# Altium schematic sheet 17 PM8916_LDO.SchDoc
size 868 x 579 mm
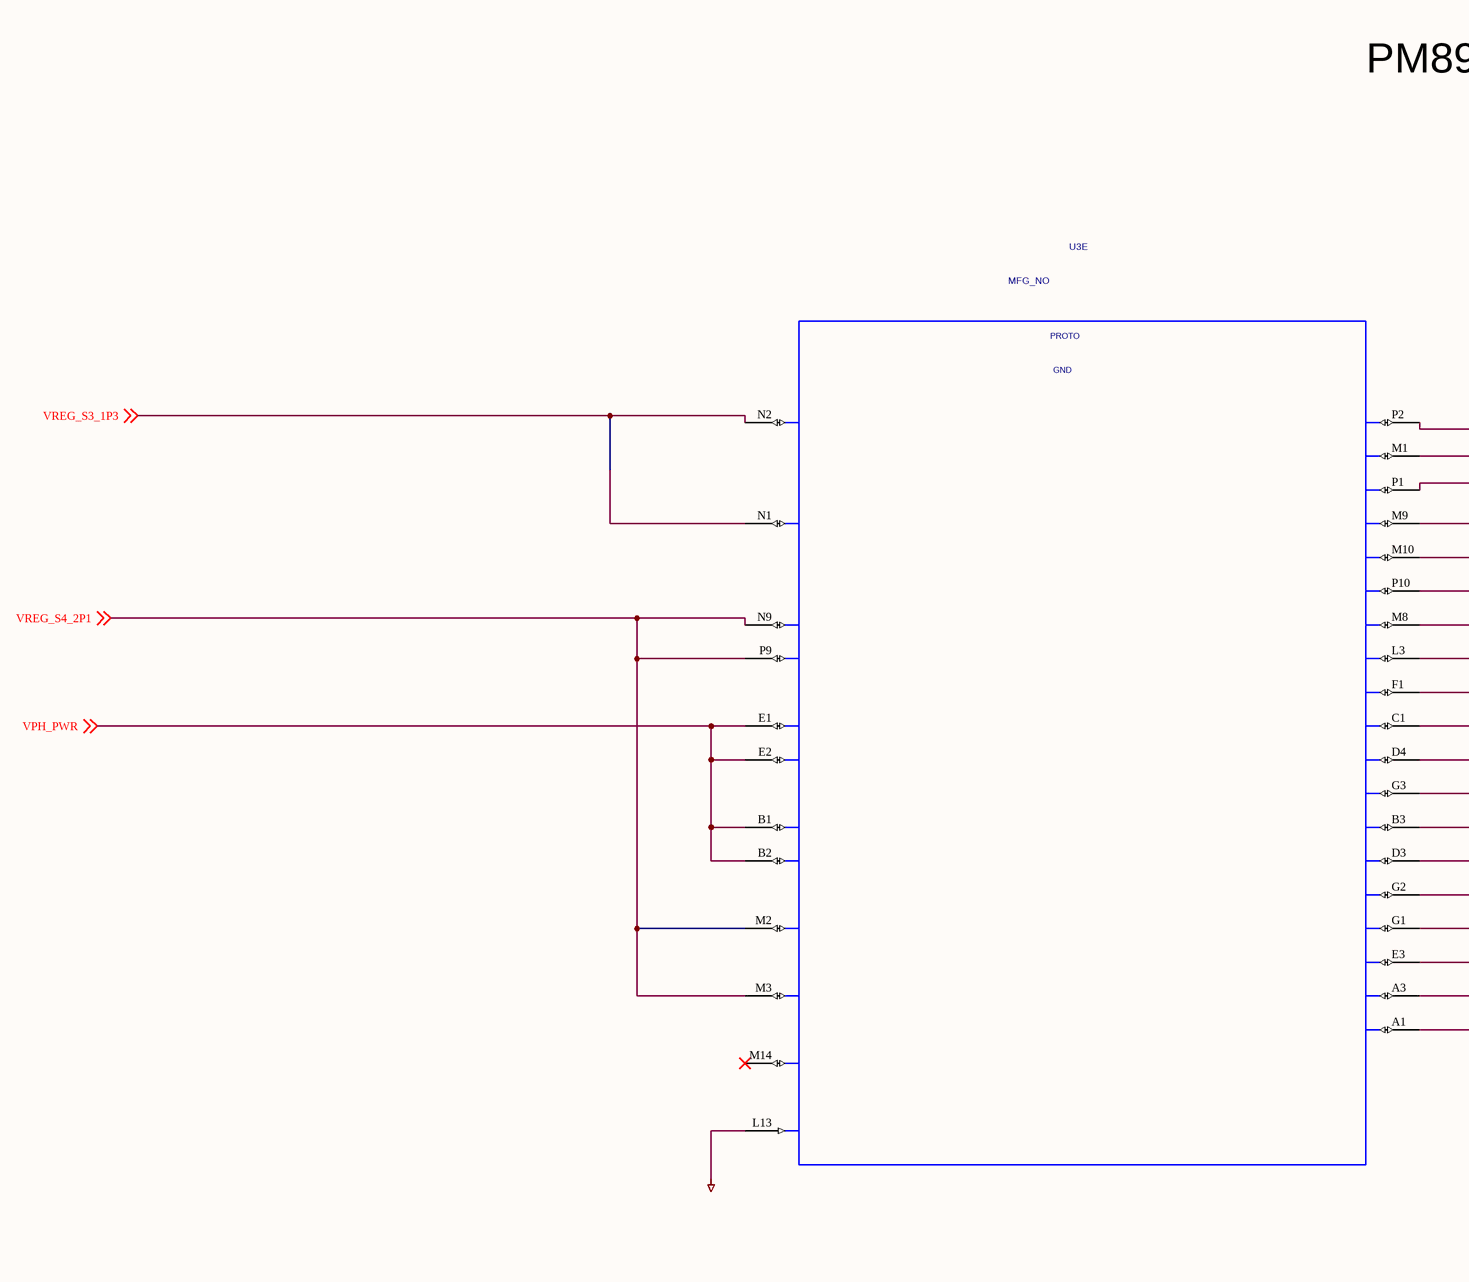
[diagram p0: 17 PM8916_LDO.SchDoc, top left]
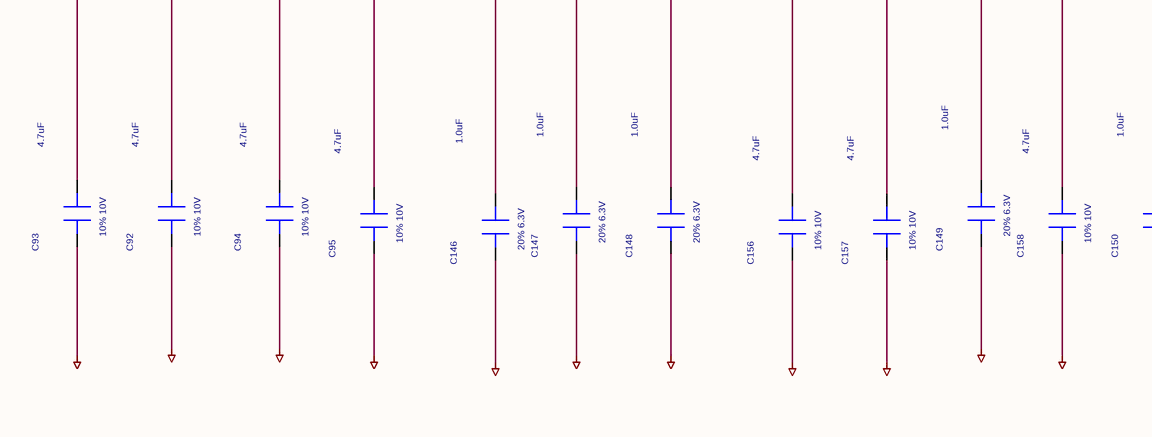
[diagram p1: 17 PM8916_LDO.SchDoc, top middle]
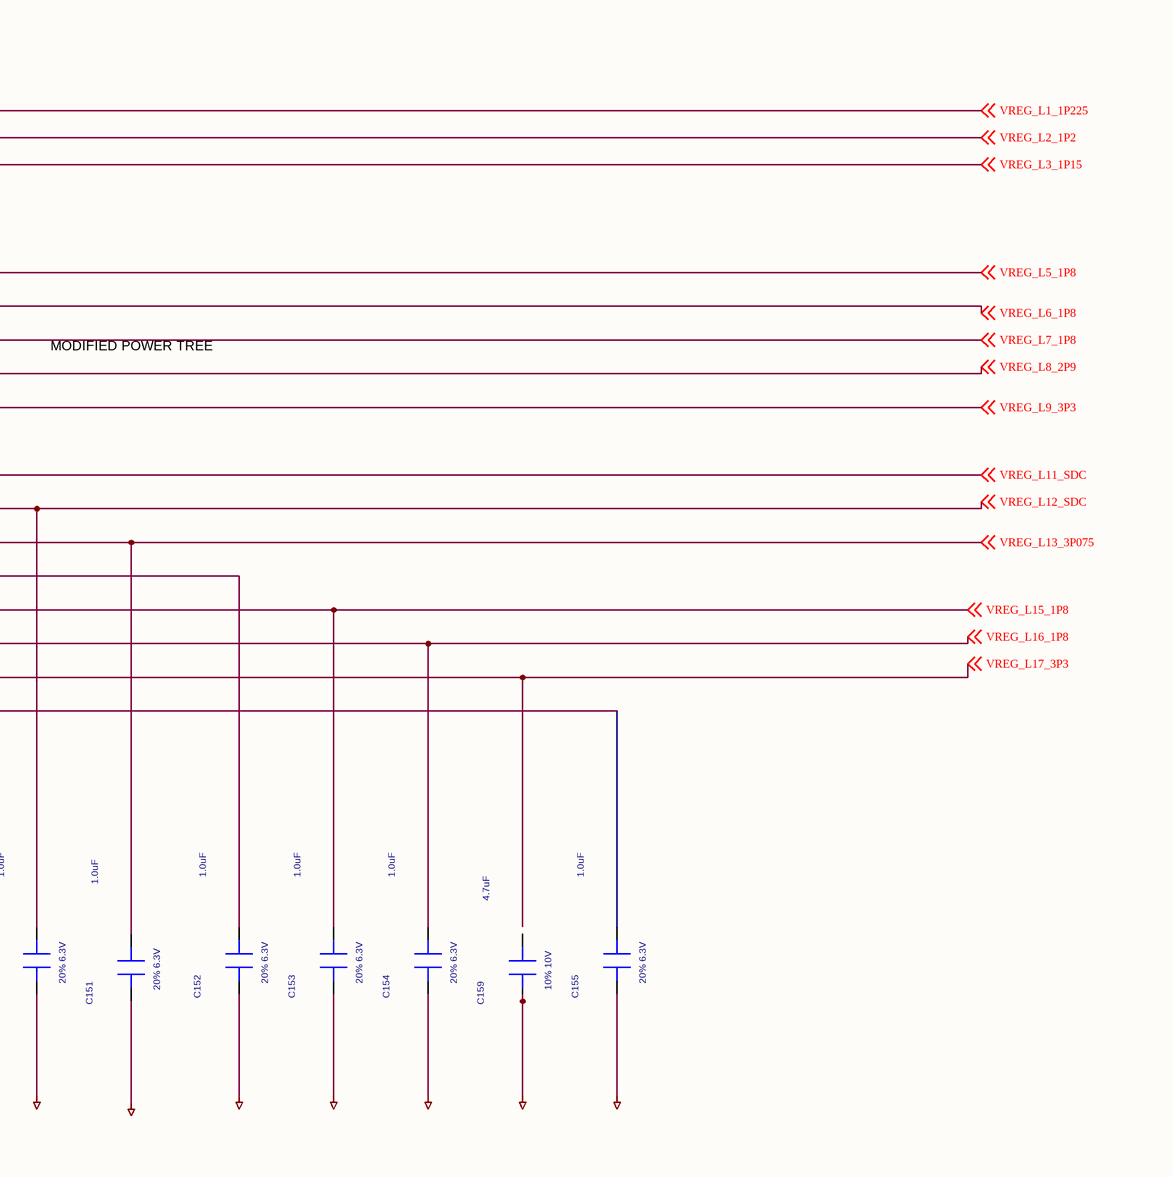
[diagram p2: 17 PM8916_LDO.SchDoc, top right]
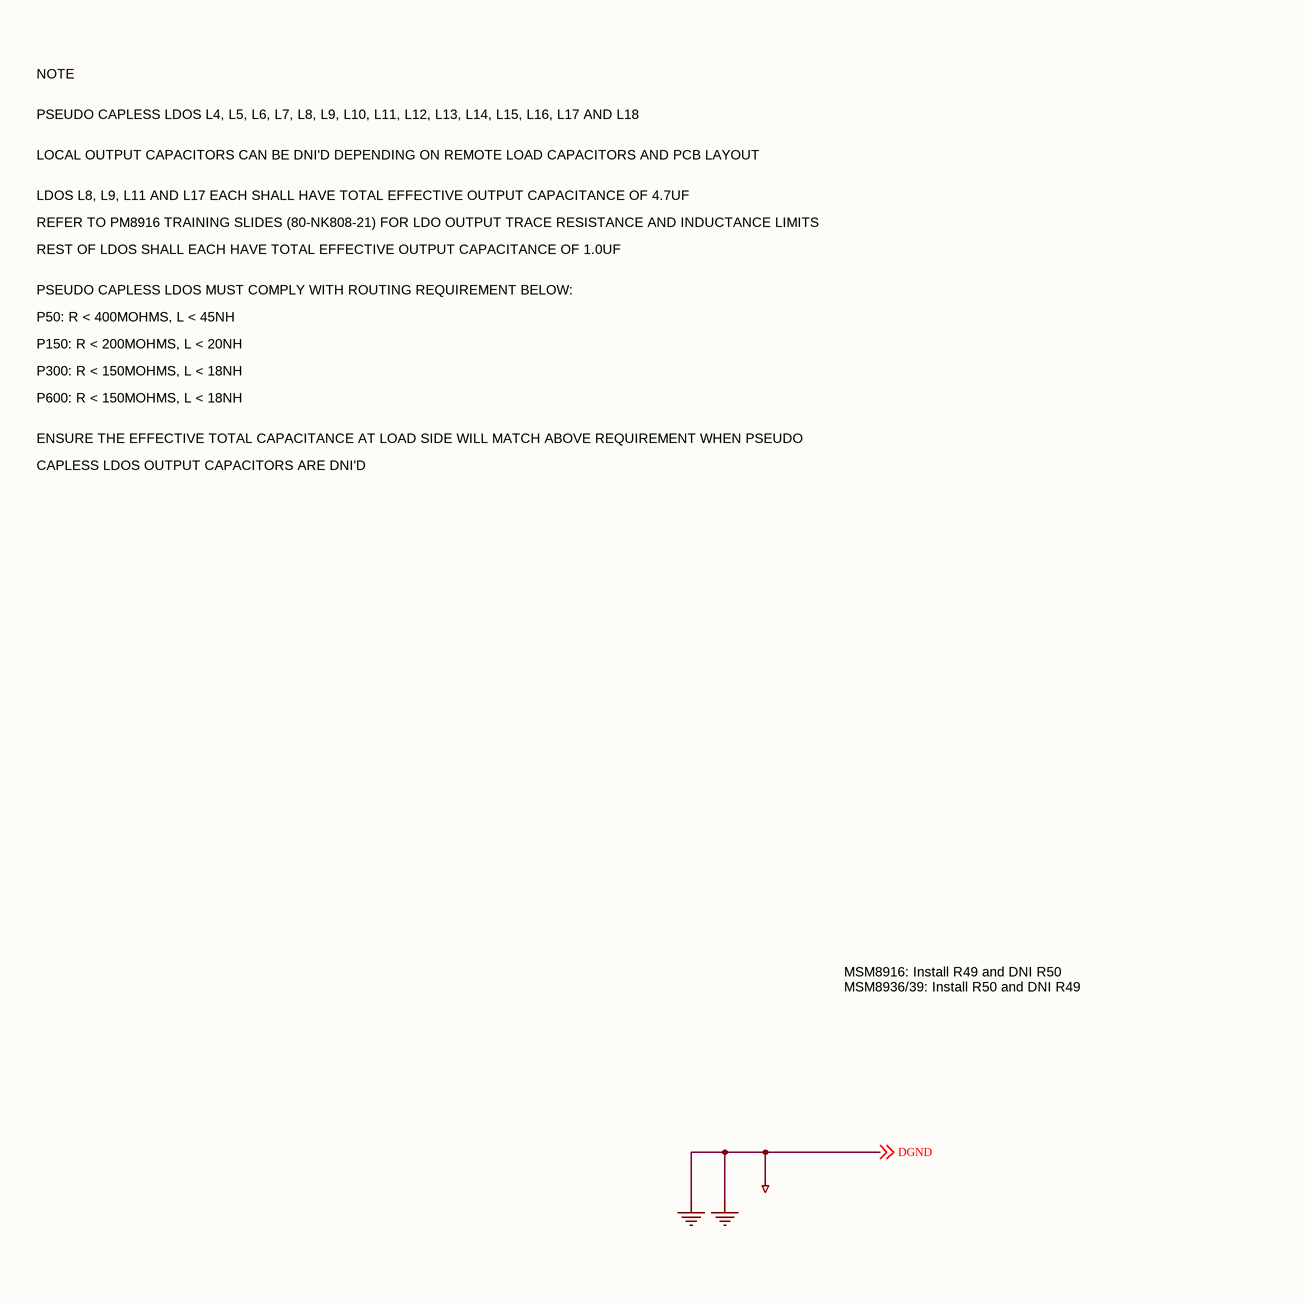
[diagram p3: 17 PM8916_LDO.SchDoc, bottom left]
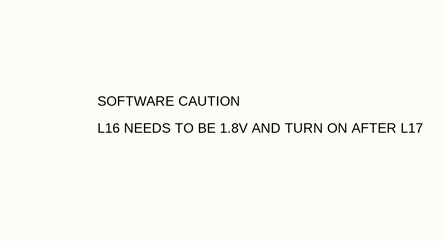
[diagram p4: 17 PM8916_LDO.SchDoc, bottom middle]
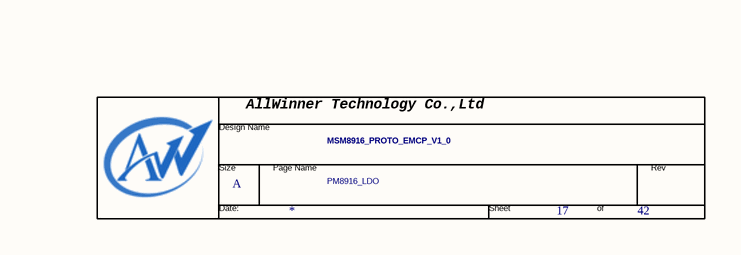
[diagram p5: 17 PM8916_LDO.SchDoc, bottom right]

## Parts
*  Page Count: 42  Page Number: 17  Page Size: A  Title: MSM8916_PROTO_EMCP_V1_0  Doc: PM8916_LDO  (hidden comment: TitleBlock0-AW)  (graphical)
C92  4.7uF  Tolerance: 10% 10V
C93  4.7uF  Tolerance: 10% 10V
C94  4.7uF  Tolerance: 10% 10V
C95  4.7uF  Tolerance: 10% 10V
C146  1.0uF  Tolerance: 20% 6.3V
C147  1.0uF  Tolerance: 20% 6.3V
C148  1.0uF  Tolerance: 20% 6.3V
C149  1.0uF  Tolerance: 20% 6.3V
C150  1.0uF  Tolerance: 20% 6.3V
C151  1.0uF  Tolerance: 20% 6.3V
C152  1.0uF  Tolerance: 20% 6.3V
C153  1.0uF  Tolerance: 20% 6.3V
C154  1.0uF  Tolerance: 20% 6.3V
C155  1.0uF  Tolerance: 20% 6.3V
C156  4.7uF  Tolerance: 10% 10V
C157  4.7uF  Tolerance: 10% 10V
C158  4.7uF  Tolerance: 10% 10V
C159  4.7uF  Tolerance: 10% 10V
U3  SYMNAME: GND  PART_ID: MFG_NO  BLOCKID: PROTO  [PM-8916-0-176NSP-TR-00-0]  (hidden comment: ASIC_PM8916)  (part E of 7)

## Nets
DGND: C92.1(POS) C93.1(POS) C94.1(POS) C95.1(POS) C146.1(POS) C147.1(POS) C148.1(POS) C149.1(POS) C150.1(POS) C151.1(POS) C152.1(POS) C153.1(POS) C154.1(POS) C155.1(POS) C156.1(POS) C157.1(POS) C158.1(POS) C159.1(POS) U3.L13(GND_DRV) ; off-sheet DGND  [also labelled GND]
VPH_PWR: U3.B1(VIN_GR5_A) U3.B2(VIN_GR5_B) U3.E1(VIN_GR4_A) U3.E2(VIN_GR4_B) ; off-sheet VPH_PWR
VREG_L1_1P225: C93.2(NEG) U3.P2(VREG_L1) ; off-sheet VREG_L1_1P225
VREG_L2_1P2: C92.2(NEG) U3.M1(VREG_L2) ; off-sheet VREG_L2_1P2
VREG_L3_1P15: C94.2(NEG) U3.P1(VREG_L3) ; off-sheet VREG_L3_1P15
VREG_L5_1P8: C146.2(NEG) U3.P10(VREG_L5) ; off-sheet VREG_L5_1P8
VREG_L6_1P8: C147.2(NEG) U3.M8(VREG_L6) ; off-sheet VREG_L6_1P8
VREG_L7_1P8: C148.2(NEG) U3.L3(VREG_L7) ; off-sheet VREG_L7_1P8
VREG_L8_2P9: C156.2(NEG) U3.F1(VREG_L8) ; off-sheet VREG_L8_2P9
VREG_L9_3P3: C157.2(NEG) U3.C1(VREG_L9) ; off-sheet VREG_L9_3P3
VREG_L11_SDC: C158.2(NEG) U3.G3(VREG_L11) ; off-sheet VREG_L11_SDC
VREG_L12_SDC: C150.2(NEG) U3.B3(VREG_L12) ; off-sheet VREG_L12_SDC
VREG_L13_3P075: C151.2(NEG) U3.D3(VREG_L13) ; off-sheet VREG_L13_3P075
VREG_L15_1P8: C153.2(NEG) U3.G1(VREG_L15) ; off-sheet VREG_L15_1P8
VREG_L16_1P8: C154.2(NEG) U3.E3(VREG_L16) ; off-sheet VREG_L16_1P8
VREG_L17_3P3: U3.A3(VREG_L17) ; off-sheet VREG_L17_3P3
VREG_S3_1P3: U3.N1(VIN_GR2) U3.N2(VIN_GR1) ; off-sheet VREG_S3_1P3
VREG_S4_2P1: U3.M2(VIN_GR6) U3.M3(VIN_GR7) U3.N9(VIN_GR3_A) U3.P9(VIN_GR3_B) ; off-sheet VREG_S4_2P1
NetC95_2: C95.2(NEG) U3.M9(VREG_L4_1) U3.M10(VREG_L4_2)
NetC149_2: C149.2(NEG) U3.D4(VREG_L10)
NetC152_2: C152.2(NEG) U3.G2(VREG_L14)
NetC155_2: C155.2(NEG) U3.A1(VREG_L18)

Not connected (* = marked no-connect by the designer): C159 2(NEG); U3 M14(VIB_DRV*)*

## Notes on the sheet
- PM8916 - LDO
- MODIFIED POWER TREE
- NOTE
- PSEUDO CAPLESS LDOS L4, L5, L6, L7, L8, L9, L10, L11, L12, L13, L14, L15, L16, L17 AND L18
- LOCAL OUTPUT CAPACITORS CAN BE DNI'D DEPENDING ON REMOTE LOAD CAPACITORS AND PCB LAYOUT
- LDOS L8, L9, L11 AND L17 EACH SHALL HAVE TOTAL EFFECTIVE OUTPUT CAPACITANCE OF 4.7UF
- SOFTWARE CAUTION
- L16 NEEDS TO BE 1.8V AND TURN ON AFTER L17
- REST OF LDOS SHALL EACH HAVE TOTAL EFFECTIVE OUTPUT CAPACITANCE OF 1.0UF
- REFER TO PM8916 TRAINING SLIDES (80-NK808-21) FOR LDO OUTPUT TRACE RESISTANCE AND INDUCTANCE LIMITS
- PSEUDO CAPLESS LDOS MUST COMPLY WITH ROUTING REQUIREMENT BELOW:
- P50: R < 400MOHMS, L < 45NH
- P150: R < 200MOHMS, L < 20NH
- P300: R < 150MOHMS, L < 18NH
- P600: R < 150MOHMS, L < 18NH
- CAPLESS LDOS OUTPUT CAPACITORS ARE DNI'D
- ENSURE THE EFFECTIVE TOTAL CAPACITANCE AT LOAD SIDE WILL MATCH ABOVE REQUIREMENT WHEN PSEUDO
- MSM8916: Install R49 and DNI R50
  MSM8936/39: Install R50 and DNI R49
- (in symbol TitleBlock0-AW) AllWinner Technology Co.,Ltd; Design Name; Size; Page Name; Rev; Date:; Sheet; of

## Library data of the parts
C92-C95 C146-C159 = CAP#1: PART_NUMBER: MCN_NO; PART_ID: MFG_NO; OriginalSymbolOrigin: (-75,50); VOLT: ?V; SYMNAME: CAP; CDS_LMAN_SYM_OUTLINE: -25,50,25,-50; PACK_TYPE: ?
U3 = ASIC_PM8916: PART_NUMBER: MCN_NO; OriginalSymbolOrigin: (-1050,1125); SPLIT_INST: TRUE; CDS_LMAN_SYM_OUTLINE: -850,1125,875,-1250; CDS_LMAN_SPLIT_NUMBER: 1 of 7; PACK_TYPE: ?
* = TitleBlock0-AW: RevCode: ?; Page Create Date: March  8, 1995; Page Modify Date: *